# EAGLE design introAu (EAGLE 6.4)
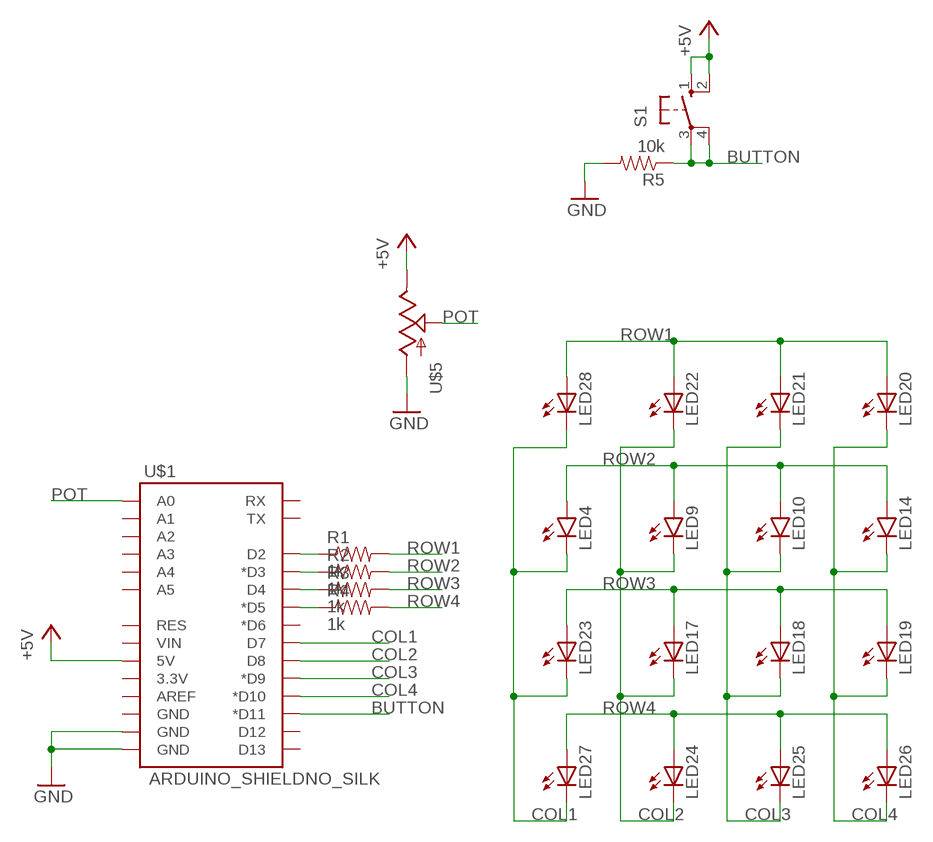
[diagram p0: schematic, sheet 1]

## Parts
LED4  LED5MM  [LED5MM]
LED9  LED5MM  [LED5MM]
LED10  LED5MM  [LED5MM]
LED14  LED5MM  [LED5MM]
LED17  LEDCHIPLED_0805  [CHIPLED_0805]
LED18  LEDCHIPLED_0805  [CHIPLED_0805]
LED19  LEDCHIPLED_0805  [CHIPLED_0805]
LED20  LEDCHIPLED_0805  [CHIPLED_0805]
LED21  LEDCHIPLED_0805  [CHIPLED_0805]
LED22  LEDCHIPLED_0805  [CHIPLED_0805]
LED23  LEDCHIPLED_0805  [CHIPLED_0805]
LED24  LEDCHIPLED_0805  [CHIPLED_0805]
LED25  LEDCHIPLED_0805  [CHIPLED_0805]
LED26  LEDCHIPLED_0805  [CHIPLED_0805]
LED27  LEDCHIPLED_0805  [CHIPLED_0805]
LED28  LEDCHIPLED_0805  [CHIPLED_0805]
R1  1k  1KOHM1/4W5%(PTH)HORIZ-KIT  [AXIAL-0.3EZ]
R2  1k  1KOHM1/4W5%(PTH)HORIZ-KIT  [AXIAL-0.3EZ]
R3  1k  1KOHM1/4W5%(PTH)HORIZ-KIT  [AXIAL-0.3EZ]
R4  1k  1KOHM1/4W5%(PTH)HORIZ-KIT  [AXIAL-0.3EZ]
R5  10k  1KOHM1/4W5%(PTH)HORIZ-KIT  [AXIAL-0.3EZ]
S1  TACT_BUTTON  [B3F-10XX]
U$1  ARDUINO_SHIELDNO_SILK  [DUEMILANOVE_VIAS]
U$5  POT  [ALPS_POT]

## Nets
+5V: S1.1(S) S1.2(S1) U$1.5V U$5.P$1(E)
BUTTON: R5.P$1 S1.3(P) S1.4(P1) U$1.D11(*D11)
COL1: LED4.K(C) LED23.C LED27.C LED28.C U$1.D7
COL2: LED9.K(C) LED17.C LED22.C LED24.C U$1.D8
COL3: LED10.K(C) LED18.C LED21.C LED25.C U$1.D9(*D9)
COL4: LED14.K(C) LED19.C LED20.C LED26.C U$1.D10(*D10)
GND: R5.P$2 U$1.GND@0(GND) U$1.GND@1(GND) U$5.P$3(A)
N$16: R1.P$1 U$1.D2
N$17: R2.P$1 U$1.D3(*D3)
N$18: R3.P$1 U$1.D4
N$19: R4.P$1 U$1.D5(*D5)
POT: U$1.A0 U$5.P$2(S)
ROW1: LED20.A LED21.A LED22.A LED28.A R1.P$2
ROW2: LED4.A LED9.A LED10.A LED14.A R2.P$2
ROW3: LED17.A LED18.A LED19.A LED23.A R3.P$2
ROW4: LED24.A LED25.A LED26.A LED27.A R4.P$2
Unconnected: U$1.3.3V U$1.A1 U$1.A2 U$1.A3 U$1.A4 U$1.A5 U$1.AREF U$1.D6(*D6) U$1.D12 U$1.D13 U$1.GND@2(GND) U$1.RES U$1.RX U$1.TX U$1.VIN

## Library data of the parts
LED4 LED9 LED10 LED14 = SparkFun-LED:LED: LEDs Standard schematic elements and footprints for 5mm, 3mm, 1206, and 0603 sized LEDs. 5mm - Spark Fun Electronics SKU : COM-00529 (and others)
LED17-LED28 = led:LED: LED OSRAM: - CHIPLED LG R971, LG N971, LY N971, LG Q971, LY Q971, LO R971, LY R971 LH N974, LH R974 LS Q976, LO Q976, LY Q976 LO Q996 - Hyper CHIPLED LW Q18S LB Q993, LB Q99A, LB R99A - SideLED LS A670, LO A670, LY A670, LG A670, LP A670 LB A673, LV A673, LT A673, LW A673 LH A674 LY A675 LS A676, LA A676, LO A676, LY A676, LW A676 LS A679, LY A679, LG A679 - Hyper Micro SIDELED® LS Y876, LA Y876, LO Y876, LY Y876 LT Y87S - SmartLED LW L88C, LW L88S LB L89C, LB L89S, LG L890 LS L89K, LO L89K, LY L89K LS L896, LA L896, LO L896, LY L896 - TOPLED LS T670, LO T670, LY T670, LG T670, LP T670 LSG T670, LSP T670, LSY T670, LOP T670, LYG T670 LG T671, LOG T671, LSG T671 LB T673, LV T673, LT T673, LW T673 LH T674 LS T676, LA T676, LO T676, LY T676, LB T676, LH T676, LSB T676, LW T676 LB T67C, LV T67C, LT T67C, LS T67K, LO T67K, LY T67K, LW E67C LS E67B, LA E67B, LO E67B, LY E67B, LB E67C, LV E67C, LT E67C LW T67C LS T679, LY T679, LG T679 LS T770, LO T770, LY T770, LG T770, LP T770 LB T773, LV T773, LT T773, LW T773 LH T774 LS E675, LA E675, LY E675, LS T675 LS T776, LA T776, LO T776, LY T776, LB T776 LHGB T686 LT T68C, LB T68C - Hyper Mini TOPLED® LB M676 - Mini TOPLED Santana® LG M470 LS M47K, LO M47K, LY M47K Source: http://www.osram.convergy.de LUXEON: - LUMILED® LXK2-PW12-R00, LXK2-PW12-S00, LXK2-PW14-U00, LXK2-PW14-V00 LXK2-PM12-R00, LXK2-PM12-S00, LXK2-PM14-U00 LXK2-PE12-Q00, LXK2-PE12-R00, LXK2-PE12-S00, LXK2-PE14-T00, LXK2-PE14-U00 LXK2-PB12-K00, LXK2-PB12-L00, LXK2-PB12-M00, LXK2-PB14-N00, LXK2-PB14-P00, LXK2-PB14-Q00 LXK2-PR12-L00, LXK2-PR12-M00, LXK2-PR14-Q00, LXK2-PR14-R00 LXK2-PD12-Q00, LXK2-PD12-R00, LXK2-PD12-S00 LXK2-PH12-R00, LXK2-PH12-S00 LXK2-PL12-P00, LXK2-PL12-Q00, LXK2-PL12-R00 Source: www.luxeon.com KINGBRIGHT: KA-3528ASYC Source: www.kingbright.com
R1-R4 = SparkFun-Resistors:1KOHM1/4W5%(PTH): RES-08380; PROD_ID: RES-08380
R5 = SparkFun-Resistors:1KOHM1/4W5%(PTH): RES-08380; PROD_ID: RES-08380; VALUE: 1k
S1 = MESH_Arduino:TACT_BUTTON: OMRON SWITCH; MPN: B3F-1000; OC_FARNELL: 176432; OC_NEWARK: 36M3542
U$1 = SparkFun-Boards:ARDUINO_SHIELD: Arduino shield footprint
U$5 = SparkFun-Electromechanical:POT

## Board
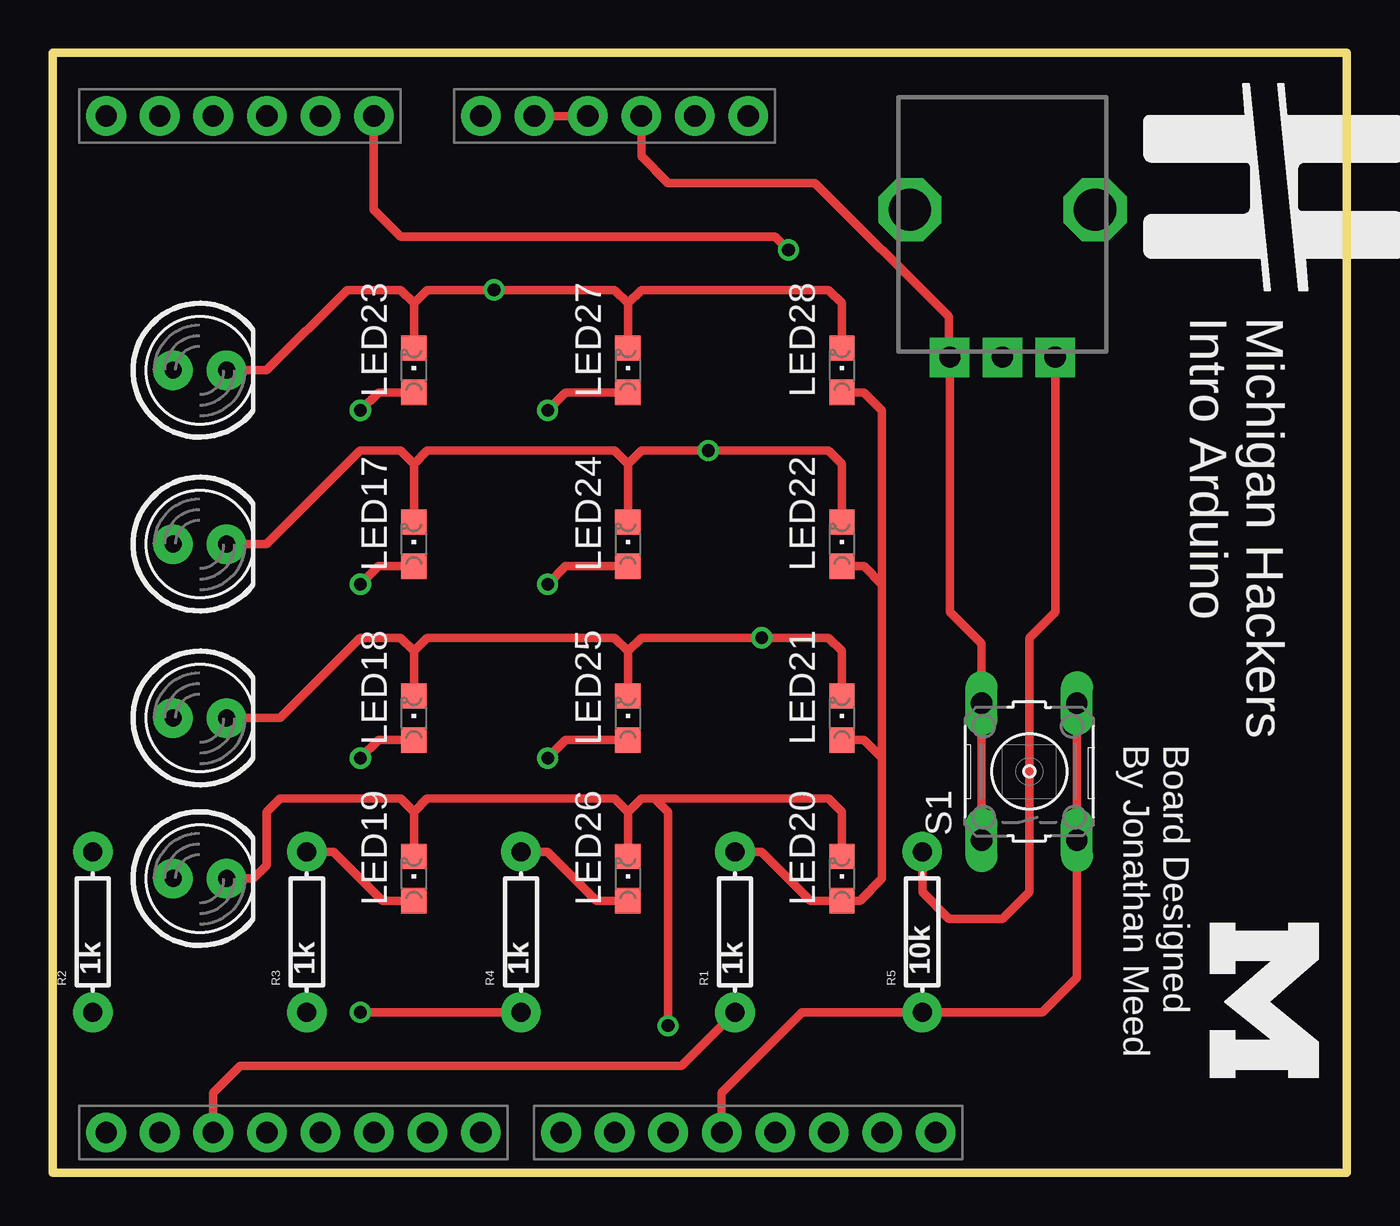
[diagram p1: board, top side]
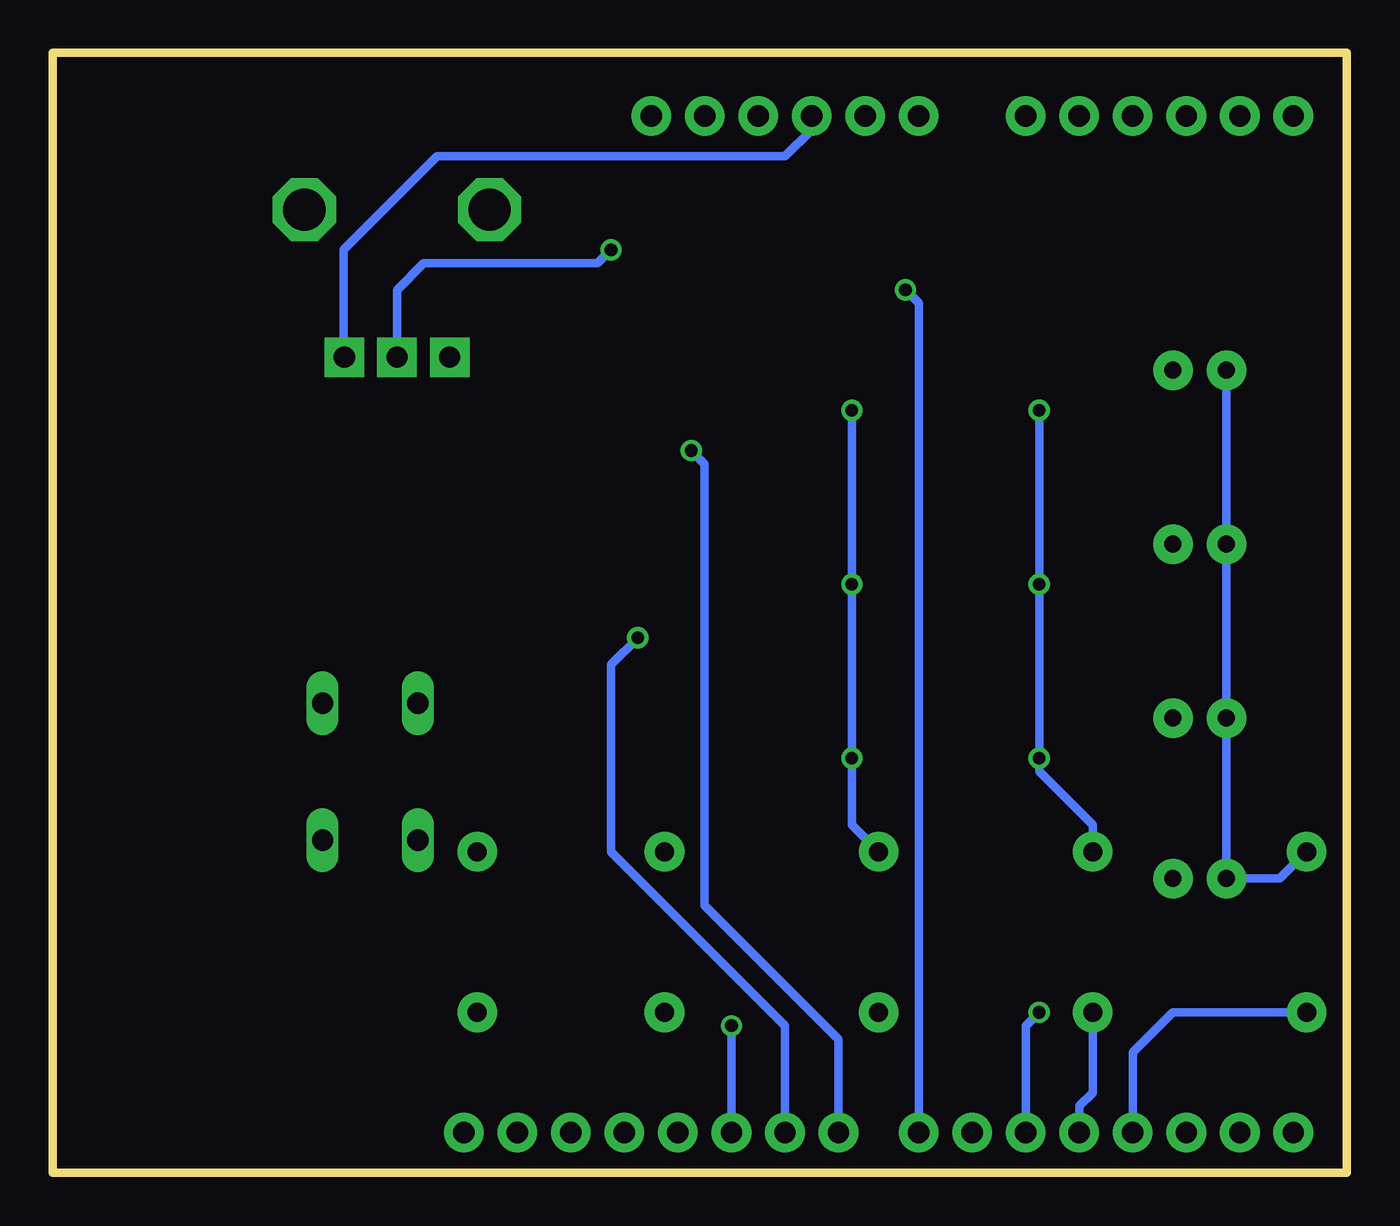
[diagram p2: board, bottom side, seen from below]

Size 61.43 x 53.17 mm. Coordinates in mm from the lower left corner, seen from the top.
Outline: 0,53.17 61.43,53.17 61.43,0 0,0 0,53.17
Copper layers (1*16): Top 0.035mm / dielectric 1.5mm / Bottom 0.035mm
Design rules "default": minimum track width 10mil, minimum drill 24mil, track to track 8mil, track to pad 8mil, pad to pad 8mil, via to via 8mil, smd to smd 8mil, copper to edge 40mil, drill to drill 8mil, minimum pad ring 10mil, minimum via ring 8mil, stop-mask expansion 4mil, vias tented up to drill 0mil, thermal gap 10mil

### Footprints (pad centres in the part's own frame; a part is rotated, then mirrored left to right if it is on the bottom)
LED5MM = drill 0.813 pad 1.88: A -1.27,0; K 1.27,0
CHIPLED_0805 = smd 1.2 x 1.2: A 0,-1.05; C 0,1.05
AXIAL-0.3EZ = drill 0.9 pad 1.88: P$1 -3.81,0; P$2 3.81,0
B3F-10XX = drill 1.016 long: 1 -3.251,2.261; 2 3.251,2.261; 3 -3.251,-2.261; 4 3.251,-2.261
DUEMILANOVE_VIAS = drill 1.016 pad 1.88: 3.3V 50.8,13.97; 5V 50.8,16.51; A0 50.8,29.21; A1 50.8,31.75; A2 50.8,34.29; A3 50.8,36.83; A4 50.8,39.37; A5 50.8,41.91; AREF 2.54,2.54; D2 2.54,36.83; D3 2.54,34.29; D4 2.54,31.75; D5 2.54,29.21; D6 2.54,26.67; D7 2.54,24.13; D8 2.54,20.32; D9 2.54,17.78; D10 2.54,15.24; D11 2.54,12.7; D12 2.54,10.16; D13 2.54,7.62; GND@0 50.8,19.05; GND@1 50.8,21.59; GND@2 2.54,5.08; RES 50.8,11.43; RX 2.54,41.91; TX 2.54,39.37; VIN 50.8,24.13
ALPS_POT = drill 1 pad 1.88 square: P$1 7,-2.5; P$2 7,0; P$3 7,2.5 | drill 2 octagon: P$4 0,-4.4; P$5 0,4.4

### Placement (x,y rotation side)
LED4  6.99,38.1 0 top
LED9  6.99,29.84 0 top
LED10  6.99,21.59 0 top
LED14  6.99,13.97 0 top
LED17  17.14,29.84 0 top
LED18  17.14,21.59 0 top
LED19  17.14,13.97 0 top
LED20  37.47,13.97 0 top
LED21  37.47,21.59 0 top
LED22  37.47,29.84 0 top
LED23  17.14,38.1 0 top
LED24  27.3,29.84 0 top
LED25  27.3,21.59 0 top
LED26  27.3,13.97 0 top
LED27  27.3,38.1 0 top
LED28  37.47,38.1 0 top
R1  32.38,11.43 90 top
R2  1.91,11.43 90 top
R3  12.06,11.43 90 top
R4  22.23,11.43 90 top
R5  41.27,11.43 90 top
S1  46.35,19.05 90 top
U$1  44.45,-0.64 90 top
U$2  [SMALL-M]  54.62,11.23 270 top
U$3  [SMALL-MH]  52.07,50.16 270 top
U$5  45.09,45.72 270 top

### Tracks (layer width: path | path; a pad name or v marks a point on that pad's centre or on a via)
+5V
  Top 0.406: U$1.5V 27.94,48.26 29.21,46.99 36.2,46.99 42.55,40.64 42.55,39.4 U$5.P$1 42.59,26.63 44.09,25.12 S1.2 S1.1
BUTTON
  Top 0.406: S1.4 S1.3 48.62,9.25 46.99,7.62 R5.P$1 35.56,7.62 31.75,3.81 U$1.D11
COL1  (via drill 0.6)
  Top 0.406: LED4.K 10.16,38.1 13.97,41.91 16.51,41.91 17.14,41.27 | LED28.C 37.47,41.27 36.83,41.91 27.94,41.91 27.3,41.27 | LED27.C 27.3,41.27 | 27.3,41.27 26.67,41.91 21.59,41.91 v20.95,41.91 17.78,41.91 17.14,41.27 | LED23.C 17.14,41.27
  Bottom 0.406: U$1.D7 20.32,41.27 v20.95,41.91
COL2  (via drill 0.6)
  Top 0.406: LED22.C 37.47,33.66 36.83,34.29 31.75,34.29 v31.11,34.29 27.94,34.29 27.3,33.66 | 27.3,33.66 LED24.C | LED17.C 17.14,33.66 | 17.14,33.66 17.78,34.29 26.67,34.29 27.3,33.66 | LED9.K 10.16,29.84 14.61,34.29 16.51,34.29 17.14,33.66
  Bottom 0.406: U$1.D8 24.13,6.35 30.48,12.7 30.48,33.66 v31.11,34.29
COL3  (via drill 0.6)
  Top 0.406: 17.14,24.77 16.51,25.4 14.61,25.4 10.79,21.59 LED10.K | LED18.C 17.14,24.77 | 17.14,24.77 17.78,25.4 26.67,25.4 27.3,24.77 | 27.3,24.77 LED25.C | LED21.C 37.47,24.77 36.83,25.4 v33.66,25.4 33.02,25.4 27.94,25.4 27.3,24.77
  Bottom 0.406: U$1.D9 26.67,6.99 34.92,15.24 34.92,24.13 v33.66,25.4
COL4  (via drill 0.6)
  Top 0.406: LED14.K 9.53,13.97 10.16,14.61 10.16,17.14 10.79,17.78 16.51,17.78 17.14,17.14 | LED19.C 17.14,17.14 | 17.14,17.14 17.78,17.78 26.67,17.78 27.3,17.14 | LED26.C 27.3,17.14 | 27.3,17.14 27.94,17.78 28.57,17.78 | 28.57,17.78 36.83,17.78 37.47,17.14 LED20.C | v29.21,6.99 29.21,17.14 28.57,17.78
  Bottom 0.406: v29.21,6.99 U$1.D10 29.21,1.27
GND
  Top 0.406: U$1.GND@1 U$1.GND@0 | U$5.P$3 47.59,26.63 46.35,25.4 46.35,13.34 45.09,12.06 42.55,12.06 41.27,13.34 R5.P$2
  Bottom 0.406: U$1.GND@0 25.4,49.53 26.67,48.26 43.18,48.26 47.62,43.81 47.62,38.76 U$5.P$3
N$16
  Top 0.406: R1.P$1 29.84,5.08 8.89,5.08 7.62,3.81 U$1.D2
N$17
  Bottom 0.406: R2.P$1 8.26,7.62 10.16,5.71 U$1.D3
N$18
  Bottom 0.406: R3.P$1 12.06,3.81 12.7,3.17 U$1.D4
N$19  (via drill 0.6)
  Top 0.406: v14.61,7.62 R4.P$1
  Bottom 0.406: U$1.D5 15.24,6.99 v14.61,7.62
POT  (via drill 0.6)
  Top 0.406: U$1.A0 15.24,45.72 16.51,44.45 34.29,44.45 v34.92,43.81
  Bottom 0.406: v34.92,43.81 35.56,43.18 43.81,43.18 45.09,41.91 U$5.P$2
ROW1
  Top 0.406: R1.P$2 33.66,15.24 35.98,12.92 LED20.A 38.32,12.92 39.37,13.97 39.37,19.68 | LED28.A 38.52,37.05 39.37,36.2 39.37,27.94 | 39.37,27.94 39.37,19.68 | LED22.A 38.52,28.8 39.37,27.94 | LED21.A 38.52,20.54 39.37,19.68
ROW2
  Bottom 0.406: R2.P$2 3.17,13.97 LED14.A LED10.A LED9.A LED4.A
ROW3  (via drill 0.6)
  Top 0.406: LED19.A 15.65,12.92 13.34,15.24 R3.P$2 | LED23.A 15.46,37.05 v14.61,36.2 | LED18.A 15.46,20.54 v14.61,19.68 | LED17.A 15.46,28.8 v14.61,27.94
  Bottom 0.406: v14.61,36.2 v14.61,27.94 v14.61,19.68 14.61,19.05 12.06,16.51 R3.P$2
ROW4  (via drill 0.6)
  Top 0.406: LED26.A 25.82,12.92 23.5,15.24 R4.P$2 | LED27.A 24.35,37.05 v23.5,36.2 | LED24.A 24.35,28.8 v23.5,27.94 | LED25.A 24.35,20.54 v23.5,19.68
  Bottom 0.406: v23.5,36.2 v23.5,27.94 23.5,20.32 v23.5,19.68 23.5,16.51 R4.P$2

### Text on the board
tNames: Michigan Hackers / Intro Arduino | Board Designed / By Jonathan Meed